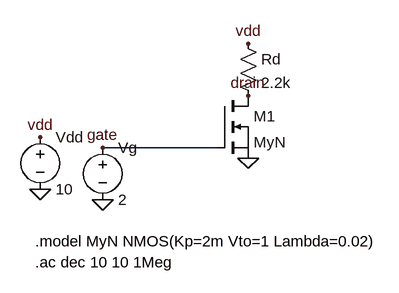
[diagram p0: schematic nmos_cs.asc]
nmos_cs.asc, the LTspice schematic file:
Version 4
SHEET 1 1600 1000
WIRE -96 96 80 96
FLAG -192 80 vdd
FLAG -192 160 0
FLAG 128 -64 vdd
FLAG 128 16 drain
FLAG 128 112 0
FLAG -96 176 0
FLAG -96 96 gate
SYMBOL voltage -192 64 R0
SYMATTR InstName Vdd
SYMATTR Value 10
SYMBOL voltage -96 80 R0
SYMATTR InstName Vg
SYMATTR Value 2
SYMATTR Value2 AC 1
SYMBOL res 112 -80 R0
SYMATTR InstName Rd
SYMATTR Value 2.2k
SYMBOL nmos 80 16 R0
SYMATTR InstName M1
SYMATTR Value MyN
SYMATTR SpiceLine l=10u w=10u
TEXT -200 240 Left 2 !.model MyN NMOS(Kp=2m Vto=1 Lambda=0.02)
TEXT -200 272 Left 2 !.ac dec 10 10 1Meg

The netlist it stands for:
* nmos_cs.asc
Vdd vdd 0 10
Vg gate 0 2 AC 1
Rd vdd drain 2.2k
M1 drain gate 0 0 MyN l=10u w=10u
.model NMOS NMOS
.model PMOS PMOS
.lib standard.mos
.model MyN NMOS(Kp=2m Vto=1 Lambda=0.02)
.ac dec 10 10 1Meg
.backanno
.end